# EAGLE schematic octanis_eps_v05 (EAGLE 7.4.0)
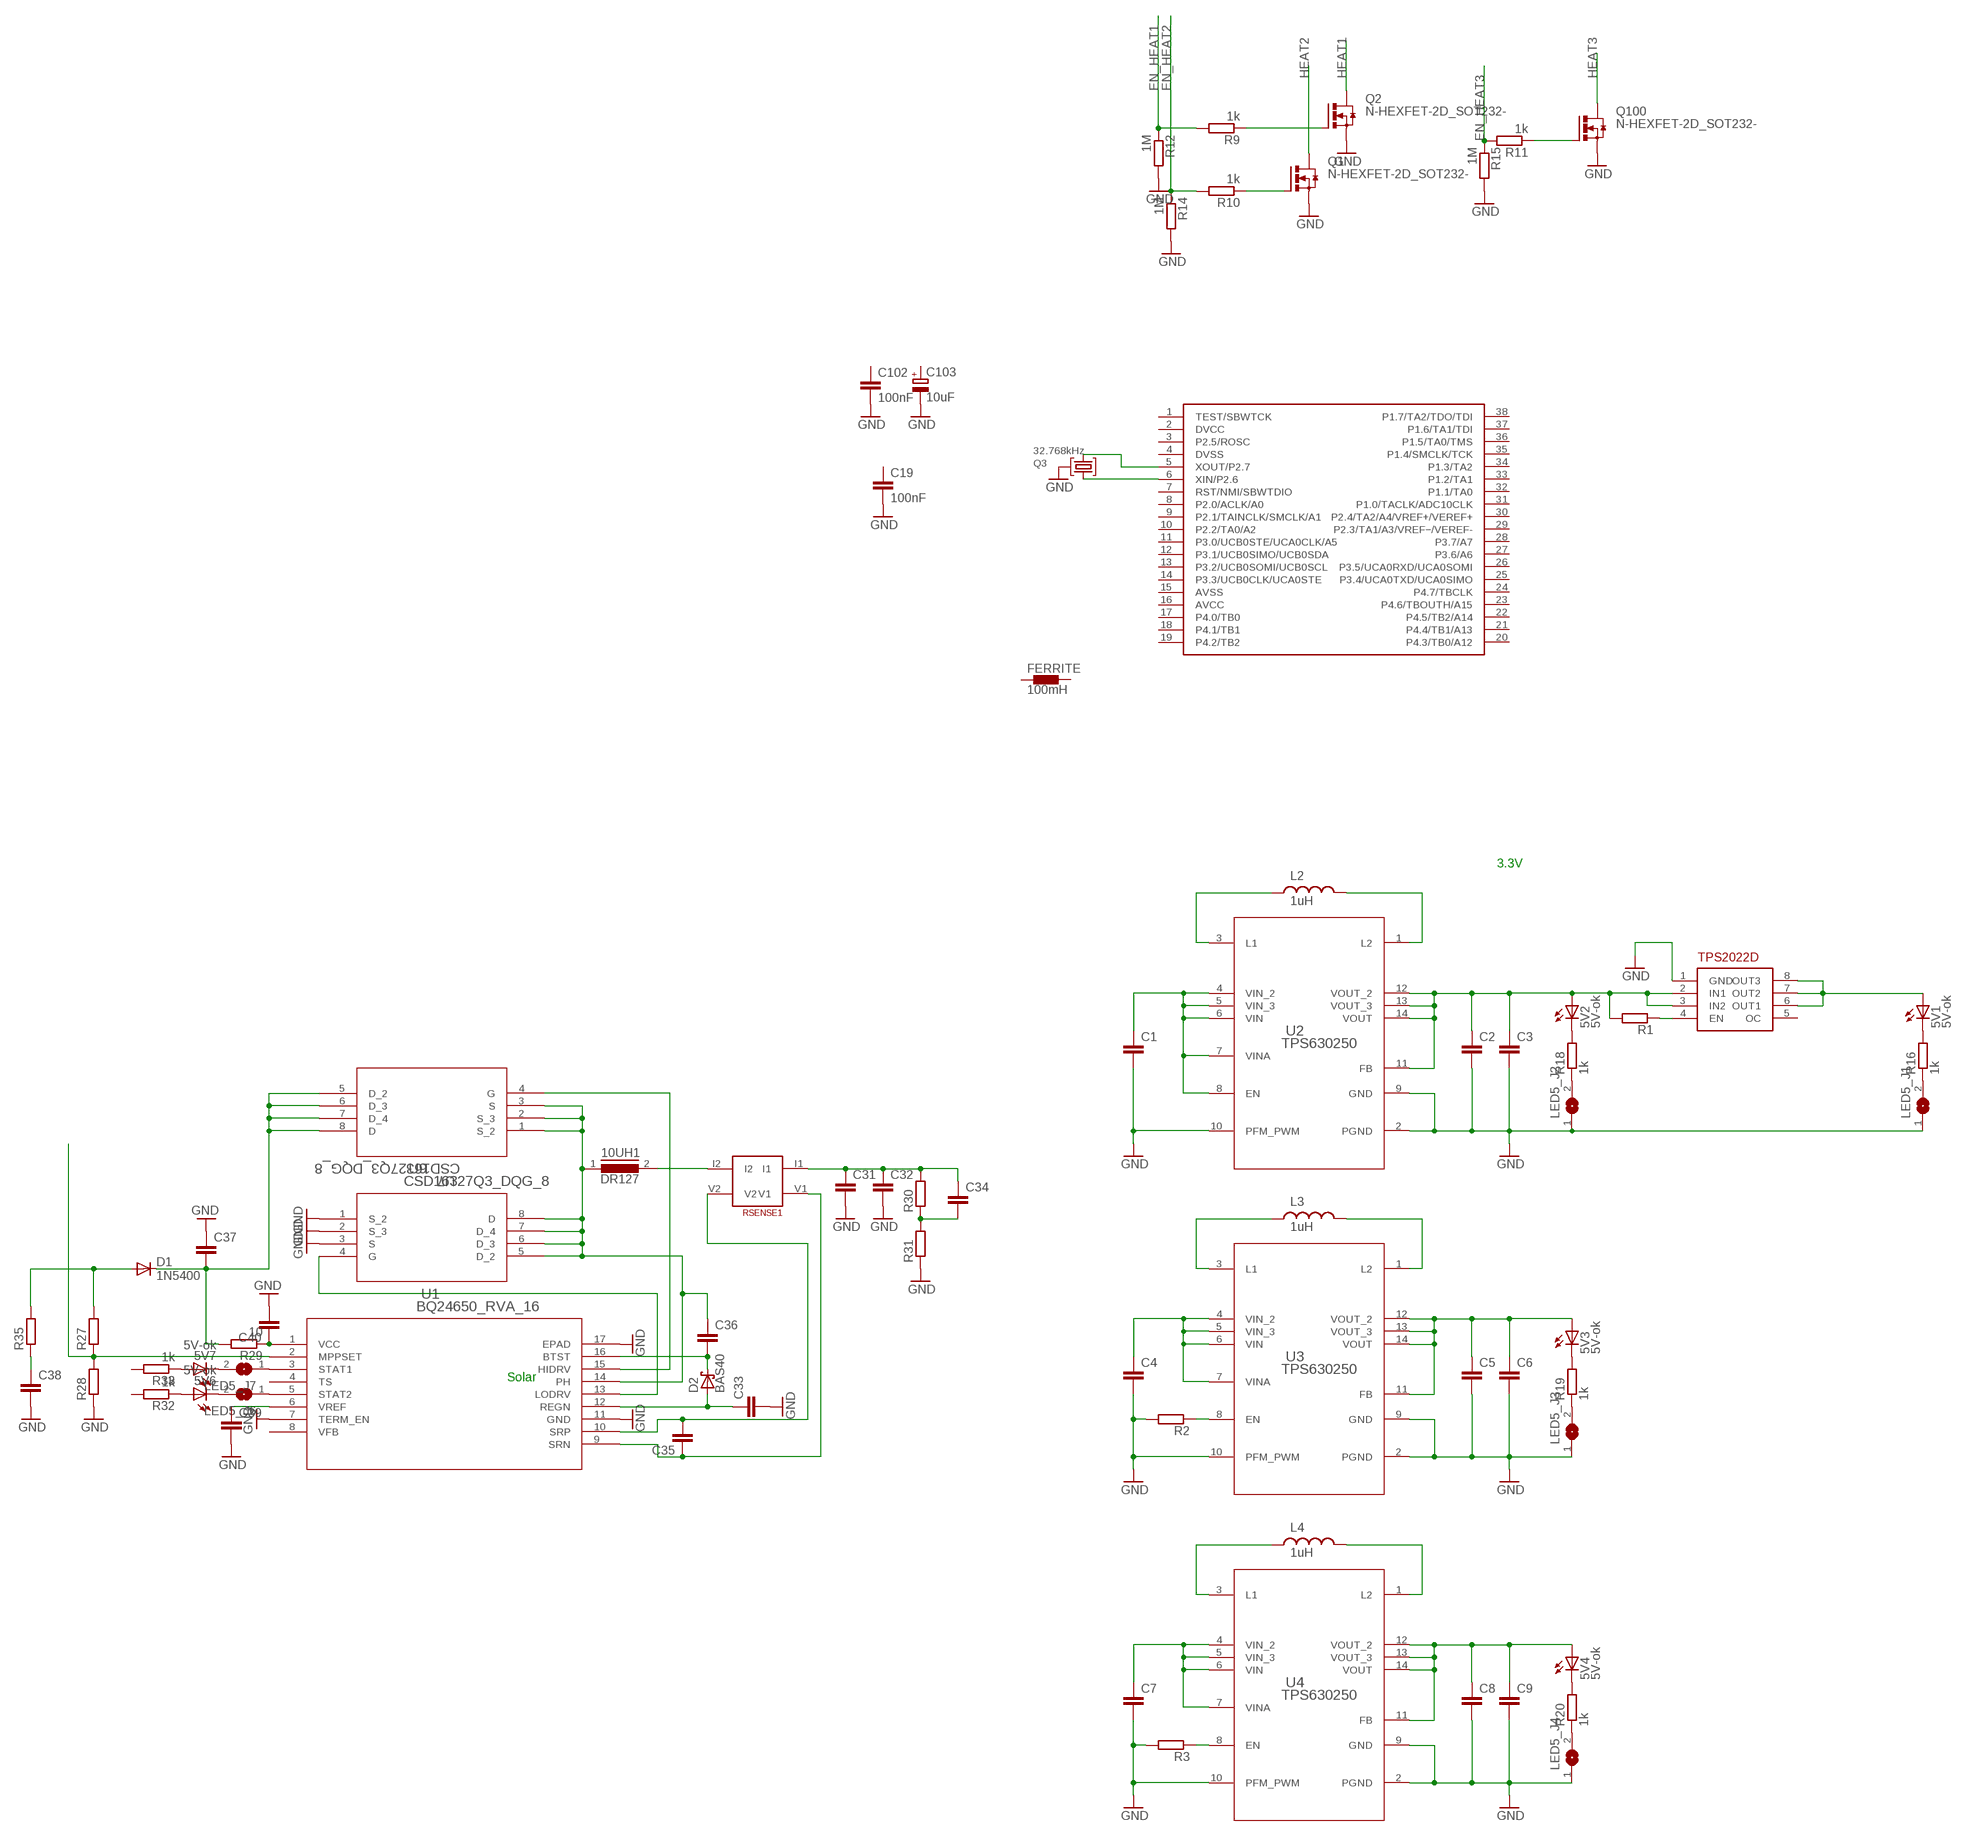
[diagram p0: schematic, sheet 1, part 1 of 2]
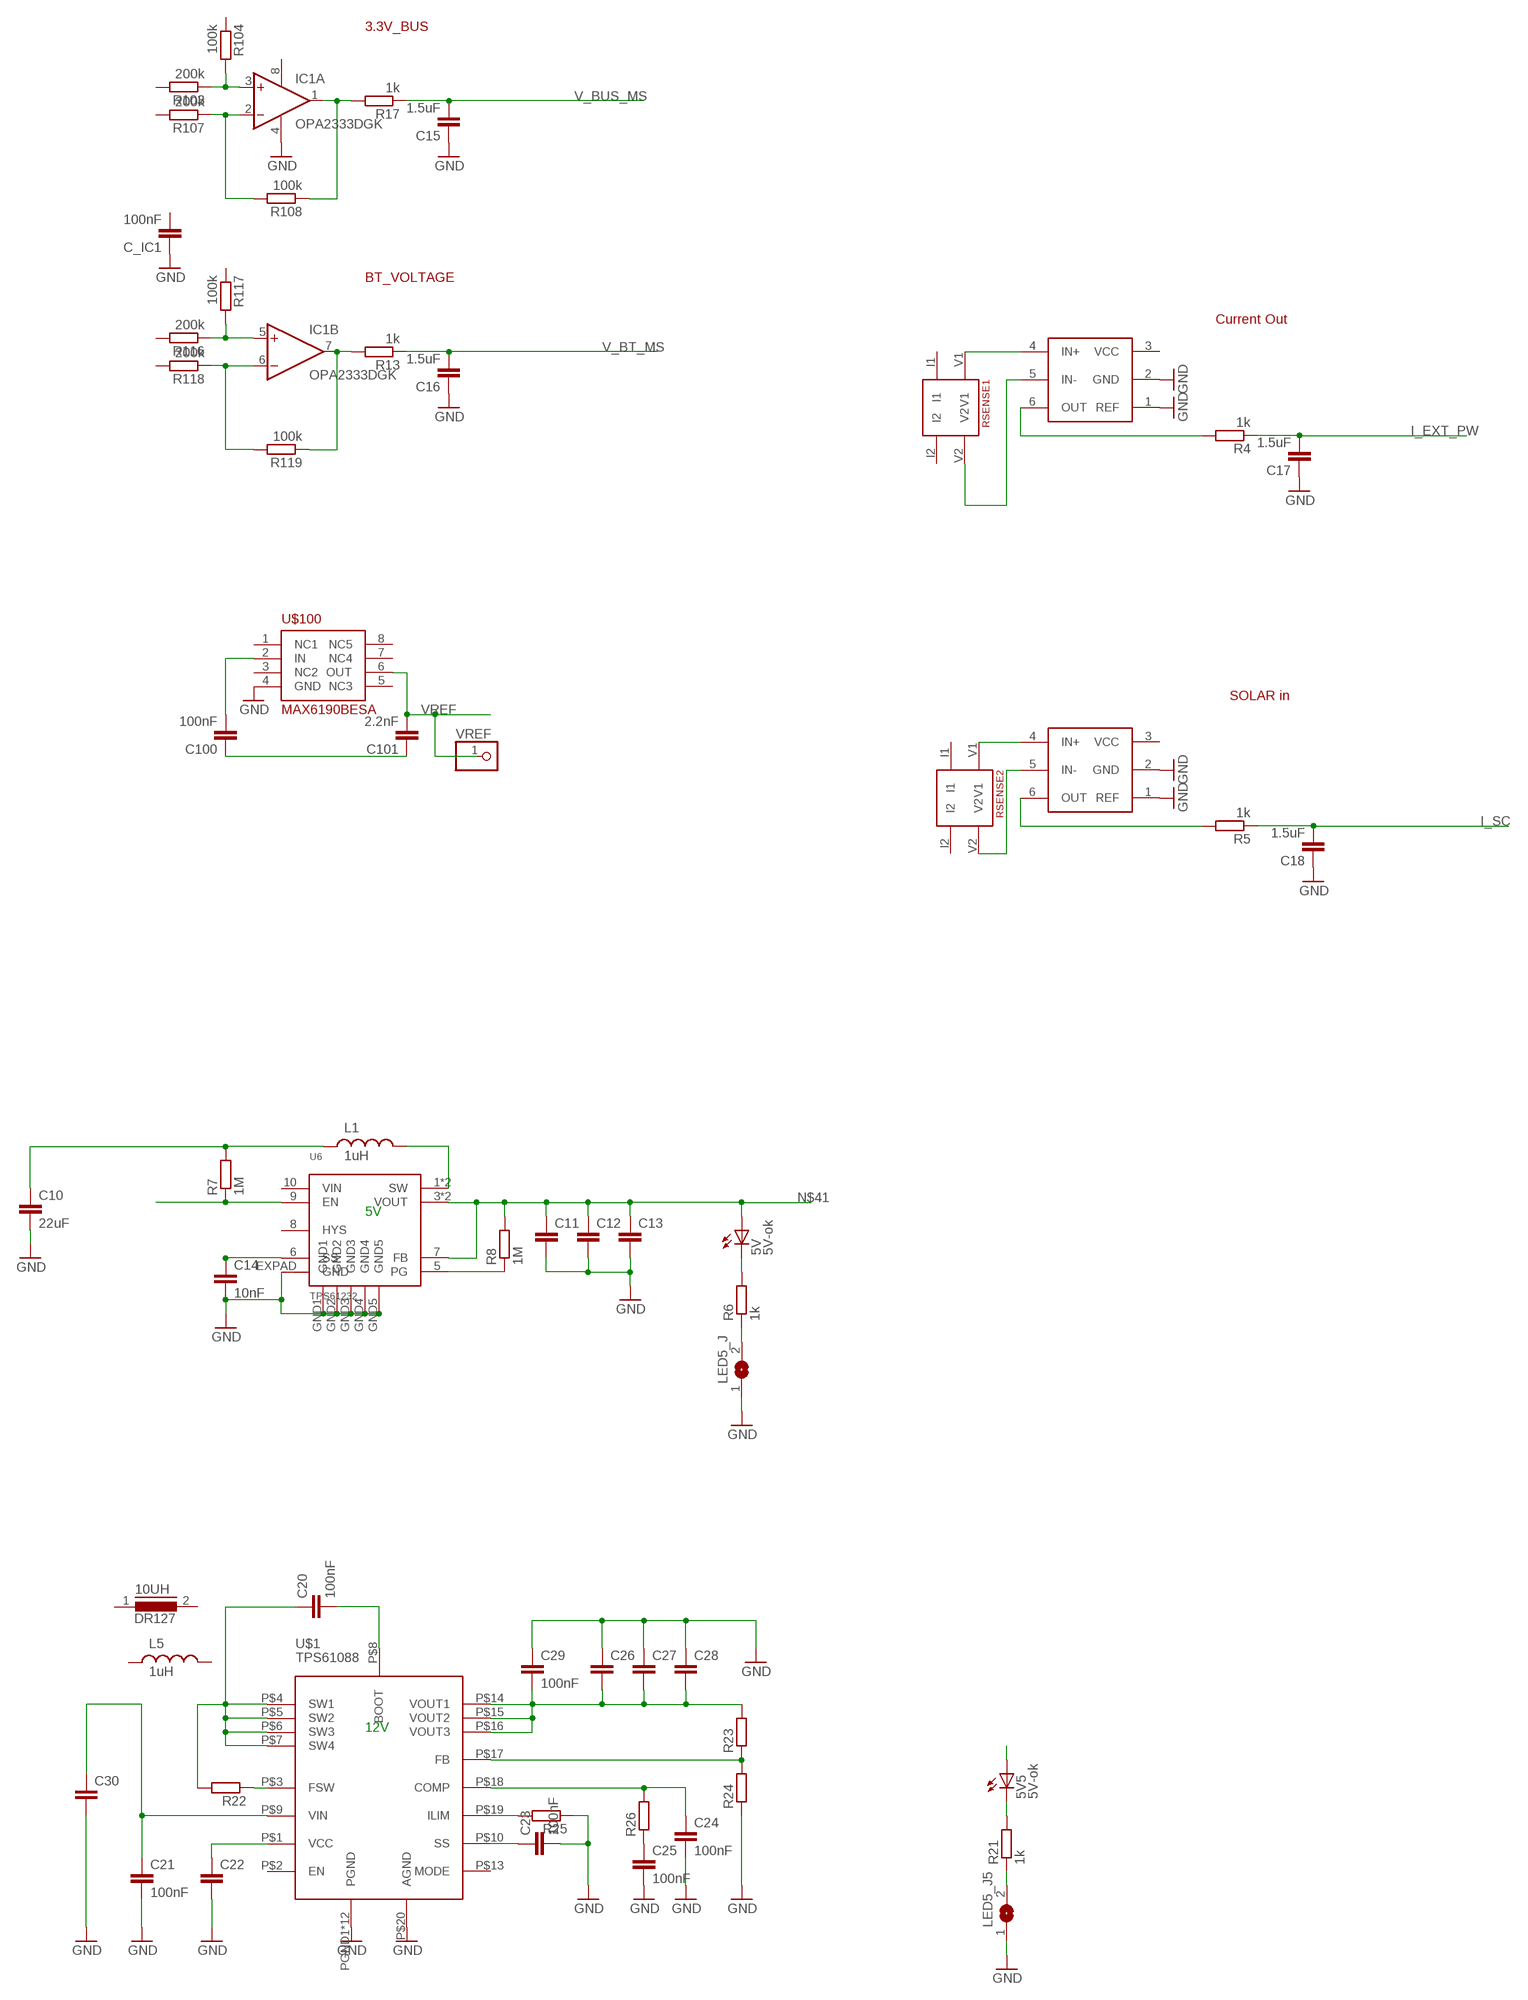
[diagram p1: schematic, sheet 1, part 2 of 2]

## Parts
5V  5V-ok  LEDCHIPLED_0603  [CHIPLED_0603]
5V1  5V-ok  LEDCHIPLED_0603  [CHIPLED_0603]
5V2  5V-ok  LEDCHIPLED_0603  [CHIPLED_0603]
5V3  5V-ok  LEDCHIPLED_0603  [CHIPLED_0603]
5V4  5V-ok  LEDCHIPLED_0603  [CHIPLED_0603]
5V5  5V-ok  LEDCHIPLED_0603  [CHIPLED_0603]
5V6  5V-ok  LEDCHIPLED_0603  [CHIPLED_0603]
5V7  5V-ok  LEDCHIPLED_0603  [CHIPLED_0603]
10UH  DR127  [DR127]
10UH1  DR127  [DR127]
C1  C-EUC0805  [C0805]
C2  C-EUC0805  [C0805]
C3  C-EUC0805  [C0805]
C4  C-EUC0805  [C0805]
C5  C-EUC0805  [C0805]
C6  C-EUC0805  [C0805]
C7  C-EUC0805  [C0805]
C8  C-EUC0805  [C0805]
C9  C-EUC0805  [C0805]
C10  22uF  C-EUC0603  [C0603]
C11  C-EUC0805  [C0805]
C12  C-EUC0805  [C0805]
C13  C-EUC0805  [C0805]
C14  10nF  C-EUC0603  [C0603]
C15  1.5uF  C-EUC0603  [C0603]
C16  1.5uF  C-EUC0603  [C0603]
C17  1.5uF  C-EUC0603  [C0603]
C18  1.5uF  C-EUC0603  [C0603]
C19  100nF  C-EUC0603  [C0603]
C20  100nF  C-EUC0603  [C0603]
C21  100nF  C-EUC0603  [C0603]
C22  C-EUC0603  [C0603]
C23  100nF  C-EUC0603  [C0603]
C24  100nF  C-EUC0603  [C0603]
C25  100nF  C-EUC0603  [C0603]
C26  C-EUC0805  [C0805]
C27  C-EUC0805  [C0805]
C28  C-EUC0805  [C0805]
C29  100nF  C-EUC0603  [C0603]
C30  C-EUC0805  [C0805]
C31  C-EUC0805  [C0805]
C32  C-EUC0805  [C0805]
C33  C-EUC0603  [C0603]
C34  C-EUC0603  [C0603]
C35  C-EUC0603  [C0603]
C36  C-EUC0603  [C0603]
C37  C-EUC0805  [C0805]
C38  C-EUC0603  [C0603]
C39  C-EUC0603  [C0603]
C40  C-EUC0603  [C0603]
C100  100nF  C-EUC0603  [C0603]
C101  2.2nF  C-EUC0603  [C0603]
C102  100nF  C-EUC0603  [C0603]
C103  10uF  CPOL-EUA/3216-18R  [A/3216-18R]
C_IC1  100nF  C-EUC0603  [C0603]
D1  1N5400  [DO201-15]
D2  BAS40  [SOT23]
FERRITE  100mH  BLM15HD601SN1  [0402]
IC1  OPA2333DGK  [MSOP08]
L1  1uH  XFL4020  [XFL4020]
L2  1uH  XFL4020  [XFL4020]
L3  1uH  XFL4020  [XFL4020]
L4  1uH  XFL4020  [XFL4020]
L5  1uH  XFL4020  [XFL4020]
LED5_J  SJ  [SJ]
LED5_J1  SJ  [SJ]
LED5_J2  SJ  [SJ]
LED5_J3  SJ  [SJ]
LED5_J4  SJ  [SJ]
LED5_J5  SJ  [SJ]
LED5_J6  SJ  [SJ]
LED5_J7  SJ  [SJ]
Q1  N-HEXFET-2D_SOT232-  [SOT223]
Q2  N-HEXFET-2D_SOT232-  [SOT223]
Q3  32.768kHz  MS3V-T1R  [MS3V-T1R]
Q100  N-HEXFET-2D_SOT232-  [SOT223]
R1  R-EU_R0603  [R0603]
R2  R-EU_R0603  [R0603]
R3  R-EU_R0603  [R0603]
R4  1k  R-EU_R0603  [R0603]
R5  1k  R-EU_R0603  [R0603]
R6  1k  R-EU_R0603  [R0603]
R7  1M  R-EU_R0603  [R0603]
R8  1M  R-EU_R0603  [R0603]
R9  1k  R-EU_R0603  [R0603]
R10  1k  R-EU_R0603  [R0603]
R11  1k  R-EU_R0603  [R0603]
R12  1M  R-EU_R0603  [R0603]
R13  1k  R-EU_R0603  [R0603]
R14  1M  R-EU_R0603  [R0603]
R15  1M  R-EU_R0603  [R0603]
R16  1k  R-EU_R0603  [R0603]
R17  1k  R-EU_R0603  [R0603]
R18  1k  R-EU_R0603  [R0603]
R19  1k  R-EU_R0603  [R0603]
R20  1k  R-EU_R0603  [R0603]
R21  1k  R-EU_R0603  [R0603]
R22  R-EU_R0603  [R0603]
R23  R-EU_R0603  [R0603]
R24  R-EU_R0603  [R0603]
R25  R-EU_R0603  [R0603]
R26  R-EU_R0603  [R0603]
R27  R-EU_R0603  [R0603]
R28  R-EU_R0603  [R0603]
R29  10  R-EU_R0603  [R0603]
R30  R-EU_R0603  [R0603]
R31  R-EU_R0603  [R0603]
R32  1k  R-EU_R0603  [R0603]
R33  1k  R-EU_R0603  [R0603]
R35  R-EU_R0603  [R0603]
R103  200k  R-EU_R0603  [R0603]
R104  100k  R-EU_R0603  [R0603]
R107  200k  R-EU_R0603  [R0603]
R108  100k  R-EU_R0603  [R0603]
R116  200k  R-EU_R0603  [R0603]
R117  100k  R-EU_R0603  [R0603]
R118  200k  R-EU_R0603  [R0603]
R119  100k  R-EU_R0603  [R0603]
R_SENSE1  RSENSE1  CURRENT_RESISTOR  [4PADS_RESISTOR]
R_SENSE2  RSENSE1  CURRENT_RESISTOR  [4PADS_RESISTOR]
RSENSE1  RSENSE2  CURRENT_RESISTOR  [4PADS_RESISTOR]
U1  BQ24650_RVA_16  [RVA16_2P14X2P14]
U2  TPS630250  TPS630250RNCR  [RNC0014A]
U3  TPS630250  TPS630250RNCR  [RNC0014A]
U4  TPS630250  TPS630250RNCR  [RNC0014A]
U5  TPS2022D  [SO8]
U6  TPS61232  [S-PVSON-N10]
U7  CSD16327Q3_DQG_8  [DQG8]
U8  MSP430G2544  [TSSOP38_MSPGXX44_SERIES]
U9  CSD16327Q3_DQG_8  [DQG8]
U$1  TPS61088  [R-PVQFN-N20]
U$2  INA213  [SC70-6]
U$3  INA213  [SC70-6]
U$100  MAX6190BESA  [SO8]
VREF  PINHD-1X1  [1X01]

## Nets
+5V5 [fine]: 5V5.A
EN_HEAT1: R9.2 R12.1
EN_HEAT2: R10.2 R14.1
EN_HEAT3: R11.2 R15.1
GND [power]: C1.2 C2.2 C3.2 C4.2 C5.2 C6.2 C7.2 C8.2 C9.2 C10.2 C11.2 C12.2 C13.2 C14.2 C15.1 C16.1 C17.1 C18.1 C19.2 C21.2 C22.2 C23.2 C24.2 C25.2 C26.1 C27.1 C28.1 C29.1 C30.2 C31.2 C32.2 C33.2 C37.1 C38.2 C39.2 C40.2 C102.2 C103.- C_IC1.1 IC1.4(P:V-) LED5_J1.1 LED5_J2.1 LED5_J3.1 LED5_J4.1 LED5_J5.1 LED5_J.1 Q1.3(S) Q2.3(S) Q3.P3(GND) Q100.3(S) R2.2 R3.2 R12.2 R14.2 R15.2 R24.1 R25.1 R28.1 R31.1 U1.7(TERM_EN) U1.11(GND) U1.17(EPAD) U2.2(PGND) U2.9(GND) U2.10(PFM_PWM) U3.2(PGND) U3.9(GND) U3.10(PFM_PWM) U4.2(PGND) U4.9(GND) U4.10(PFM_PWM) U5.1(GND) U6.EXPAD(GND) U6.GND1 U6.GND2 U6.GND3 U6.GND4 U6.GND5 U9.1(S_2) U9.2(S_3) U9.3(S) U$1.P$20(AGND) U$1.PGND1(PGND) U$1.PGND2(PGND) U$1.PGND3(PGND) U$1.PGND4(PGND) U$1.PGND5(PGND) U$1.PGND6(PGND) U$1.PGND7(PGND) U$1.PGND8(PGND) U$1.PGND9(PGND) U$1.PGND10(PGND) U$1.PGND11(PGND) U$1.PGND12(PGND) U$2.1(REF) U$2.2(GND) U$3.1(REF) U$3.2(GND) U$100.4(GND)
HEAT1: Q2.2(D) Q2.4(D)
HEAT2: Q1.2(D) Q1.4(D)
HEAT3: Q100.2(D) Q100.4(D)
I_EXT_PW: C17.2 R4.1
I_SC: C18.2 R5.1
IND: L1.P$2 U6.1(SW) U6.2(SW)
N$1: L2.P$1 U2.3(L1)
N$2: R8.1 U6.5(PG)
N$3: L2.P$2 U2.1(L2)
N$4: C1.1 U2.4(VIN_2) U2.5(VIN_3) U2.6(VIN) U2.7(VINA) U2.8(EN)
N$5: R1.1 U5.4(EN)
N$6: L3.P$1 U3.3(L1)
N$7: L3.P$2 U3.1(L2)
N$8: 5V1.A U5.6(OUT1) U5.7(OUT2) U5.8(OUT3)
N$9: C4.1 U3.4(VIN_2) U3.5(VIN_3) U3.6(VIN) U3.7(VINA)
N$10: R2.1 U3.8(EN)
N$11: L4.P$1 U4.3(L1)
N$12: L4.P$2 U4.1(L2)
N$13: C7.1 U4.4(VIN_2) U4.5(VIN_3) U4.6(VIN) U4.7(VINA)
N$14: LED5_J.2 R6.1
N$15: R3.1 U4.8(EN)
N$16: 5V3.A C5.1 C6.1 U3.11(FB) U3.12(VOUT_2) U3.13(VOUT_3) U3.14(VOUT)
N$17: 5V4.A C8.1 C9.1 U4.11(FB) U4.12(VOUT_2) U4.13(VOUT_3) U4.14(VOUT)
N$18: 5V2.A C2.1 C3.1 R1.2 U2.11(FB) U2.12(VOUT_2) U2.13(VOUT_3) U2.14(VOUT) U5.2(IN1) U5.3(IN2)
N$19: IC1.1(A:OUT) R17.2 R108.1
N$20: IC1.2(A:-IN) R107.1 R108.2
N$21: IC1.3(A:+IN) R103.1 R104.2
N$22: IC1.7(B:OUT) R13.2 R119.1
N$23: IC1.6(B:-IN) R118.1 R119.2
N$24: IC1.5(B:+IN) R116.1 R117.2
N$25: R4.2 U$3.6(OUT)
N$26: R5.2 U$2.6(OUT)
N$27: Q2.1(G) R9.1
N$28: C100.2 U$100.2(IN)
N$29 [power]: C100.1 C101.1
N$30: Q3.P1 U8.6(XIN/P2.6)
N$31: Q1.1(G) R10.1
N$32: R_SENSE1.V1 U$3.4(IN+)
N$33: R_SENSE1.V2 U$3.5(IN-)
N$34: RSENSE1.V1 U$2.4(IN+)
N$35: RSENSE1.V2 U$2.5(IN-)
N$36: Q3.P2 U8.5(XOUT/P2.7)
N$37: Q100.1(G) R11.1
N$38: C20.2 U$1.P$8(BOOT)
N$39: 5V1.C R16.2
N$40: LED5_J1.2 R16.1
N$41 [fine]: 5V.A C11.1 C12.1 C13.1 R8.2 U6.3(VOUT) U6.4(VOUT) U6.7(FB)
N$42: C14.1 U6.6(SS)
N$43: 5V2.C R18.2
N$44: 5V.C R6.2
N$45: LED5_J2.2 R18.1
N$46: 5V4.C R20.2
N$47: LED5_J4.2 R20.1
N$48: 5V5.C R21.2
N$49: LED5_J5.2 R21.1
N$50: C20.1 R22.2 U$1.P$4(SW1) U$1.P$5(SW2) U$1.P$6(SW3) U$1.P$7(SW4)
N$51: 5V3.C R19.2
N$52: LED5_J3.2 R19.1
N$53: R22.1 U$1.P$3(FSW)
N$54: C25.1 R26.1
N$55: R7.1 U6.9(EN)
N$56: C23.1 U$1.P$10(SS)
N$57: R25.2 U$1.P$19(ILIM)
N$58: C24.1 R26.2 U$1.P$18(COMP)
N$59: C22.1 U$1.P$1(VCC)
N$60: R23.1 R24.2 U$1.P$17(FB)
N$61: C26.2 C27.2 C28.2 C29.2 R23.2 U$1.P$14(VOUT1) U$1.P$15(VOUT2) U$1.P$16(VOUT3)
N$62: C21.1 C30.1 U$1.P$9(VIN)
N$63: C10.1 L1.P$1 R7.2
N$64: R27.1 R28.2 U1.2(MPPSET)
N$65: C38.1 R35.1
N$66: 5V7.A R33.1
N$67: 5V6.C LED5_J6.2
N$68: 5V7.C LED5_J7.2
N$69: 5V6.A R32.1
N$70: LED5_J6.1 U1.5(STAT2)
N$71: LED5_J7.1 U1.3(STAT1)
N$72: C39.1 U1.6(VREF)
N$73: C40.1 R29.1 U1.1(VCC)
N$74: D1.A R27.2 R35.2
N$75: C37.2 D1.C R29.2 U7.5(D_2) U7.6(D_3) U7.7(D_4) U7.8(D)
N$76: 10UH1.1 C36.1 U1.14(PH) U7.1(S_2) U7.2(S_3) U7.3(S) U9.5(D_2) U9.6(D_3) U9.7(D_4) U9.8(D)
N$77: C35.2 R_SENSE2.V2 U1.10(SRP)
N$78: C35.1 R_SENSE2.V1 U1.9(SRN)
N$79: 10UH1.2 R_SENSE2.I2
N$80: U1.15(HIDRV) U7.4(G)
N$81: U1.13(LODRV) U9.4(G)
N$82: C34.2 R30.1 R31.2
N$83: C31.1 C32.1 C34.1 R30.2 R_SENSE2.I1
N$84: C33.1 D2.1(A) U1.12(REGN)
N$85: C36.2 D2.3(C) U1.16(BTST)
V_BT_MS: C16.2 R13.1
V_BUS_MS: C15.2 R17.1
VREF: C101.2 U$100.6(OUT) VREF.1
Unconnected: 10UH.1 10UH.2 C19.1 C102.1 C103.+ C_IC1.2 FERRITE.1 FERRITE.2 L5.P$1 L5.P$2 R32.2 R33.2 R103.2 R104.1 R107.2 R116.2 R117.1 R118.2 R_SENSE1.I1 R_SENSE1.I2 RSENSE1.I1 RSENSE1.I2 U1.4(TS) U1.8(VFB) U5.5(OC) U6.8(HYS) U6.10(VIN) U8.1(TEST/SBWTCK) U8.2(DVCC) U8.3(P2.5/ROSC) U8.4(DVSS) U8.7(RST/NMI/SBWTDIO) U8.8(P2.0/ACLK/A0) U8.9(P2.1/TAINCLK/SMCLK/A1) U8.10(P2.2/TA0/A2) U8.11(P3.0/UCB0STE/UCA0CLK/A5) U8.12(P3.1/UCB0SIMO/UCB0SDA) U8.13(P3.2/UCB0SOMI/UCB0SCL) U8.14(P3.3/UCB0CLK/UCA0STE) U8.15(AVSS) U8.16(AVCC) U8.17(P4.0/TB0) U8.18(P4.1/TB1) U8.19(P4.2/TB2) U8.20(P4.3/TB0/A12) U8.21(P4.4/TB1/A13) U8.22(P4.5/TB2/A14) U8.23(P4.6/TBOUTH/A15) U8.24(P4.7/TBCLK) U8.25(P3.4/UCA0TXD/UCA0SIMO) U8.26(P3.5/UCA0RXD/UCA0SOMI) U8.27(P3.6/A6) U8.28(P3.7/A7) U8.29(P2.3/TA1/A3/VREF−/VEREF-) U8.30(P2.4/TA2/A4/VREF+/VEREF+) U8.31(P1.0/TACLK/ADC10CLK) U8.32(P1.1/TA0) U8.33(P1.2/TA1) U8.34(P1.3/TA2) U8.35(P1.4/SMCLK/TCK) U8.36(P1.5/TA0/TMS) U8.37(P1.6/TA1/TDI) U8.38(P1.7/TA2/TDO/TDI) U$1.P$2(EN) U$1.P$13(MODE) U$2.3(VCC) U$3.3(VCC) U$100.1(NC1) U$100.3(NC2) U$100.5(NC3) U$100.7(NC4) U$100.8(NC5)

## Notes on the sheet
- 3.3V_BUS
- BT_VOLTAGE
- Current Out
- SOLAR in
- 3.3V
- 5V
- Solar
- 12V

## Power pins joined to a net without a drawn wire
V+: IC1.8(P:V+)

## Library data of the parts
5V 5V1-5V7 = adafruit:LED: LED OSRAM: - CHIPLED LG R971, LG N971, LY N971, LG Q971, LY Q971, LO R971, LY R971 LH N974, LH R974 LS Q976, LO Q976, LY Q976 LO Q996 - Hyper CHIPLED LW Q18S LB Q993, LB Q99A, LB R99A - SideLED LS A670, LO A670, LY A670, LG A670, LP A670 LB A673, LV A673, LT A673, LW A673 LH A674 LY A675 LS A676, LA A676, LO A676, LY A676, LW A676 LS A679, LY A679, LG A679 - Hyper Micro SIDELED® LS Y876, LA Y876, LO Y876, LY Y876 LT Y87S - SmartLED LW L88C, LW L88S LB L89C, LB L89S, LG L890 LS L89K, LO L89K, LY L89K LS L896, LA L896, LO L896, LY L896 - TOPLED LS T670, LO T670, LY T670, LG T670, LP T670 LSG T670, LSP T670, LSY T670, LOP T670, LYG T670 LG T671, LOG T671, LSG T671 LB T673, LV T673, LT T673, LW T673 LH T674 LS T676, LA T676, LO T676, LY T676, LB T676, LH T676, LSB T676, LW T676 LB T67C, LV T67C, LT T67C, LS T67K, LO T67K, LY T67K, LW E67C LS E67B, LA E67B, LO E67B, LY E67B, LB E67C, LV E67C, LT E67C LW T67C LS T679, LY T679, LG T679 LS T770, LO T770, LY T770, LG T770, LP T770 LB T773, LV T773, LT T773, LW T773 LH T774 LS E675, LA E675, LY E675, LS T675 LS T776, LA T776, LO T776, LY T776, LB T776 LHGB T686 LT T68C, LB T68C - Hyper Mini TOPLED® LB M676 - Mini TOPLED Santana® LG M470 LS M47K, LO M47K, LY M47K Source: http://www.osram.convergy.de/
10UH 10UH1 = inductors:DR127: High Power Density, High Efficiency, Shielded Inductors Source: coiltronics_dr_series.pdf
C1-C9 C11-C13 C26-C28 C30-C32 C37 = resistor:C-EU: CAPACITOR, European symbol
C10 C14-C25 C29 C33-C36 C38-C40 C100-C102 C_IC1 = rcl:C-EU: CAPACITOR, European symbol
C103 = rcl:CPOL-EU: POLARIZED CAPACITOR, European symbol
D1 = diode:1N5400: DIODE standard rectifier, 3 A, 50 V (Motorola)
D2 = diode:BAS40: Silicon Schottky Diodes General-purpose diode for high-speed switching
FERRITE = inductors:BLM15H: EMIFIL (R) Chip Ferrite Bead for GHz Noise Source: http://www.murata.com/ Ferrite Bead BLM15H.pdf
IC1 = linear:OPA2333: DUAL 1.8V, microPOWER CMOS OPERATIONAL AMPLIFIERS Zerø-Drift Series Source: Texas Instruments (Burr-Brown) .. U11 opa333 Operational Amp.pdf
L1-L5 = Coilcraft:XFL4020
LED5_J LED5_J1-LED5_J7 = jumper:SJ: SMD solder JUMPER
Q1 Q2 Q100 = transistor-power:N-HEXFET-2D_?-*: HEXFET® Power MOSFET 2 Drain connects http://www.irf.com/product-info/datasheets/data/irll014n.pdf
Q3 = microcrystal:MS3V-T1R
R1-R3 R22-R26 = resistor:R-EU_: RESISTOR, European symbol
R4-R21 R27-R33 R35 R103 R104 R107 R108 R116-R119 = rcl:R-EU_: RESISTOR, European symbol
R_SENSE1 R_SENSE2 RSENSE1 = Octanis1_EPS:CURRENT_RESISTOR
U1 = texasinstruments:BQ24650_RVA_16; DATASHEETURL: http://www.ti.com/lit/gpn/BQ24650; DESCRIPTION: High Efficiency Synchronous Switch-Mode Charger Controller  Solar Battery Charger; FAMILY_NAME: BATTERY CHARGE MANAGEMENT; GENERIC_PART_NUMBER: BQ24650; INDUSTRY_STD_PKG_TYPE: VQFN; MANUFACTURER: Texas Instruments; PACKAGE_DESIGNATOR: RVA; PIN_COUNT: 16
U2-U4 = texasinstruments:TPS630250RNCR; ALTERNATEPARTNUMBER: TPS630250RNCT; COMPTYPE: IC; MANUFACTURER: Texas Instruments; MOUNTTYPE: SMT; PACKAGEREFERENCE: RNC0014A; PARTNUMBER: TPS630250RNCR; PIN_COUNT: 14; REFDES: RefDes; TYPE: TYPE; VALUE: Value
U5 = Octanis1_EPS:TPS2022D: TEXAS INSTRUMENTS - TPS2022D - IC, 1.5A PWR DIST SWITCH 8SOIC
U6 = texasinstruments:TPS61232: Up to 96% Efficiency Synchronous Boost Converter 3.3 V to 5 V Power Conversion with 2.1 A Output Current Input Supply Voltage Supervisor with Adjustable Threshold/ Hysteresis Power Save Mode for Light Load Efficiency Load Disconnect During Shutdown Output Over Voltage Protection Programmable Soft Start Power Good Output Input Voltage Range: 2.3 V to 5.5 V Output Voltage Range: 2.5 V to 5.5 V 2 MHz Switching Frequency Output Capacitor Discharge (TPS61231) 3 mm × 3 mm × 0.9 mm SON Package
U7 U9 = texasinstruments:CSD16327Q3_DQG_8; DATASHEETURL: http://www.ti.com/lit/gpn/CSD16327Q3; DESCRIPTION: N-Channel NexFET Power MOSFET; FAMILY_NAME: N-Channel MOSFET Transistors; GENERIC_PART_NUMBER: CSD16327Q3; INDUSTRY_STD_PKG_TYPE: SON; MANUFACTURER: Texas Instruments; PACKAGE_DESIGNATOR: DQG; PIN_COUNT: 8
U8 = Octanis1_EPS:MSP430G2544: MSP430G2x44 Mixed-Signal Microcontrollers
U$1 = texasinstruments:TPS61088
U$2 U$3 = Octanis1_EPS:INA213: Voltage Output, High or Low Side Measurement, Bi-Directional Zer ø -Drift Series Current-Shunt Monitor
U$100 = Octanis1_EPS:MAX6190BESA: MAX6190–MAX6195/MAX6198 Precision, Micropower, Low-Dropout Voltage References
VREF = pinhead:PINHD-1X1: PIN HEADER

## Net classes
0 default: clearance 0.205 mm
1 power: width 0.203 mm, drill 0.305 mm, clearance 0.152 mm
3 fine: width 0.406 mm, drill 0.61 mm, clearance 0.152 mm